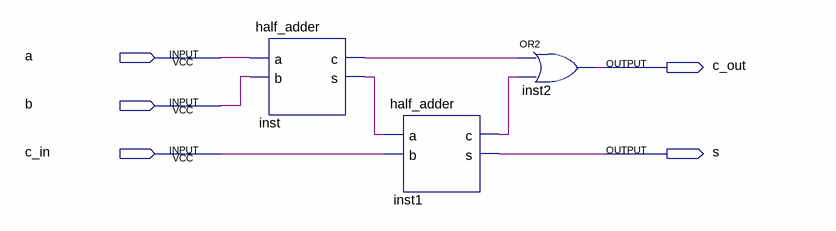
[diagram p0: schematic sheet]
// Quartus schematic full_adder.bdf as structural Verilog: 3 symbols, 5 pins
module full_adder (
  input  a,
  input  b,
  input  c_in,
  output c_out,
  output s
);

  wire inst1_c, inst_c, inst_s;

  half_adder inst (.a(a), .b(b), .c(inst_c), .s(inst_s));
  half_adder inst1 (.a(inst_s), .b(c_in), .c(inst1_c), .s(s));
  or inst2 (c_out, inst_c, inst1_c);
endmodule
